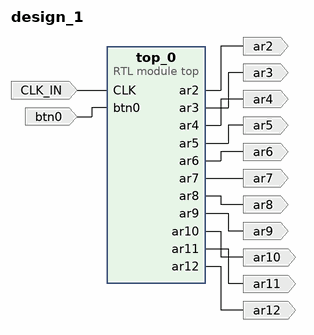
[diagram p0: block diagram of the top level]
# Vivado block design design_1, xc7z020clg400-1, Vivado 2022.2
create_bd_design design_1

create_bd_port -dir I btn0
create_bd_port -dir O ar2
create_bd_port -dir O ar12
create_bd_port -dir O ar11
create_bd_port -dir O ar3
create_bd_port -dir O ar4
create_bd_port -dir O ar10
create_bd_port -dir O ar9
create_bd_port -dir O ar5
create_bd_port -dir O ar8
create_bd_port -dir O ar7
create_bd_port -dir O ar6
create_bd_port -dir I -type clk CLK_IN
set_property -dict {CONFIG.FREQ_HZ 125000000} [get_bd_ports CLK_IN]

create_bd_cell -type module -reference top top_0

# ---- connections ----

connect_bd_net [get_bd_ports CLK_IN] [get_bd_pins top_0/CLK]
connect_bd_net -net btn0_1 [get_bd_ports btn0] [get_bd_pins top_0/btn0]
connect_bd_net [get_bd_pins top_0/ar2] [get_bd_ports ar2]
connect_bd_net [get_bd_pins top_0/ar3] [get_bd_ports ar3]
connect_bd_net [get_bd_pins top_0/ar4] [get_bd_ports ar4]
connect_bd_net [get_bd_pins top_0/ar5] [get_bd_ports ar5]
connect_bd_net [get_bd_pins top_0/ar6] [get_bd_ports ar6]
connect_bd_net [get_bd_pins top_0/ar7] [get_bd_ports ar7]
connect_bd_net [get_bd_pins top_0/ar8] [get_bd_ports ar8]
connect_bd_net [get_bd_pins top_0/ar9] [get_bd_ports ar9]
connect_bd_net [get_bd_pins top_0/ar10] [get_bd_ports ar10]
connect_bd_net [get_bd_pins top_0/ar11] [get_bd_ports ar11]
connect_bd_net [get_bd_pins top_0/ar12] [get_bd_ports ar12]

validate_bd_design
save_bd_design
